# Altium schematic sheet power.SchDoc
size A3
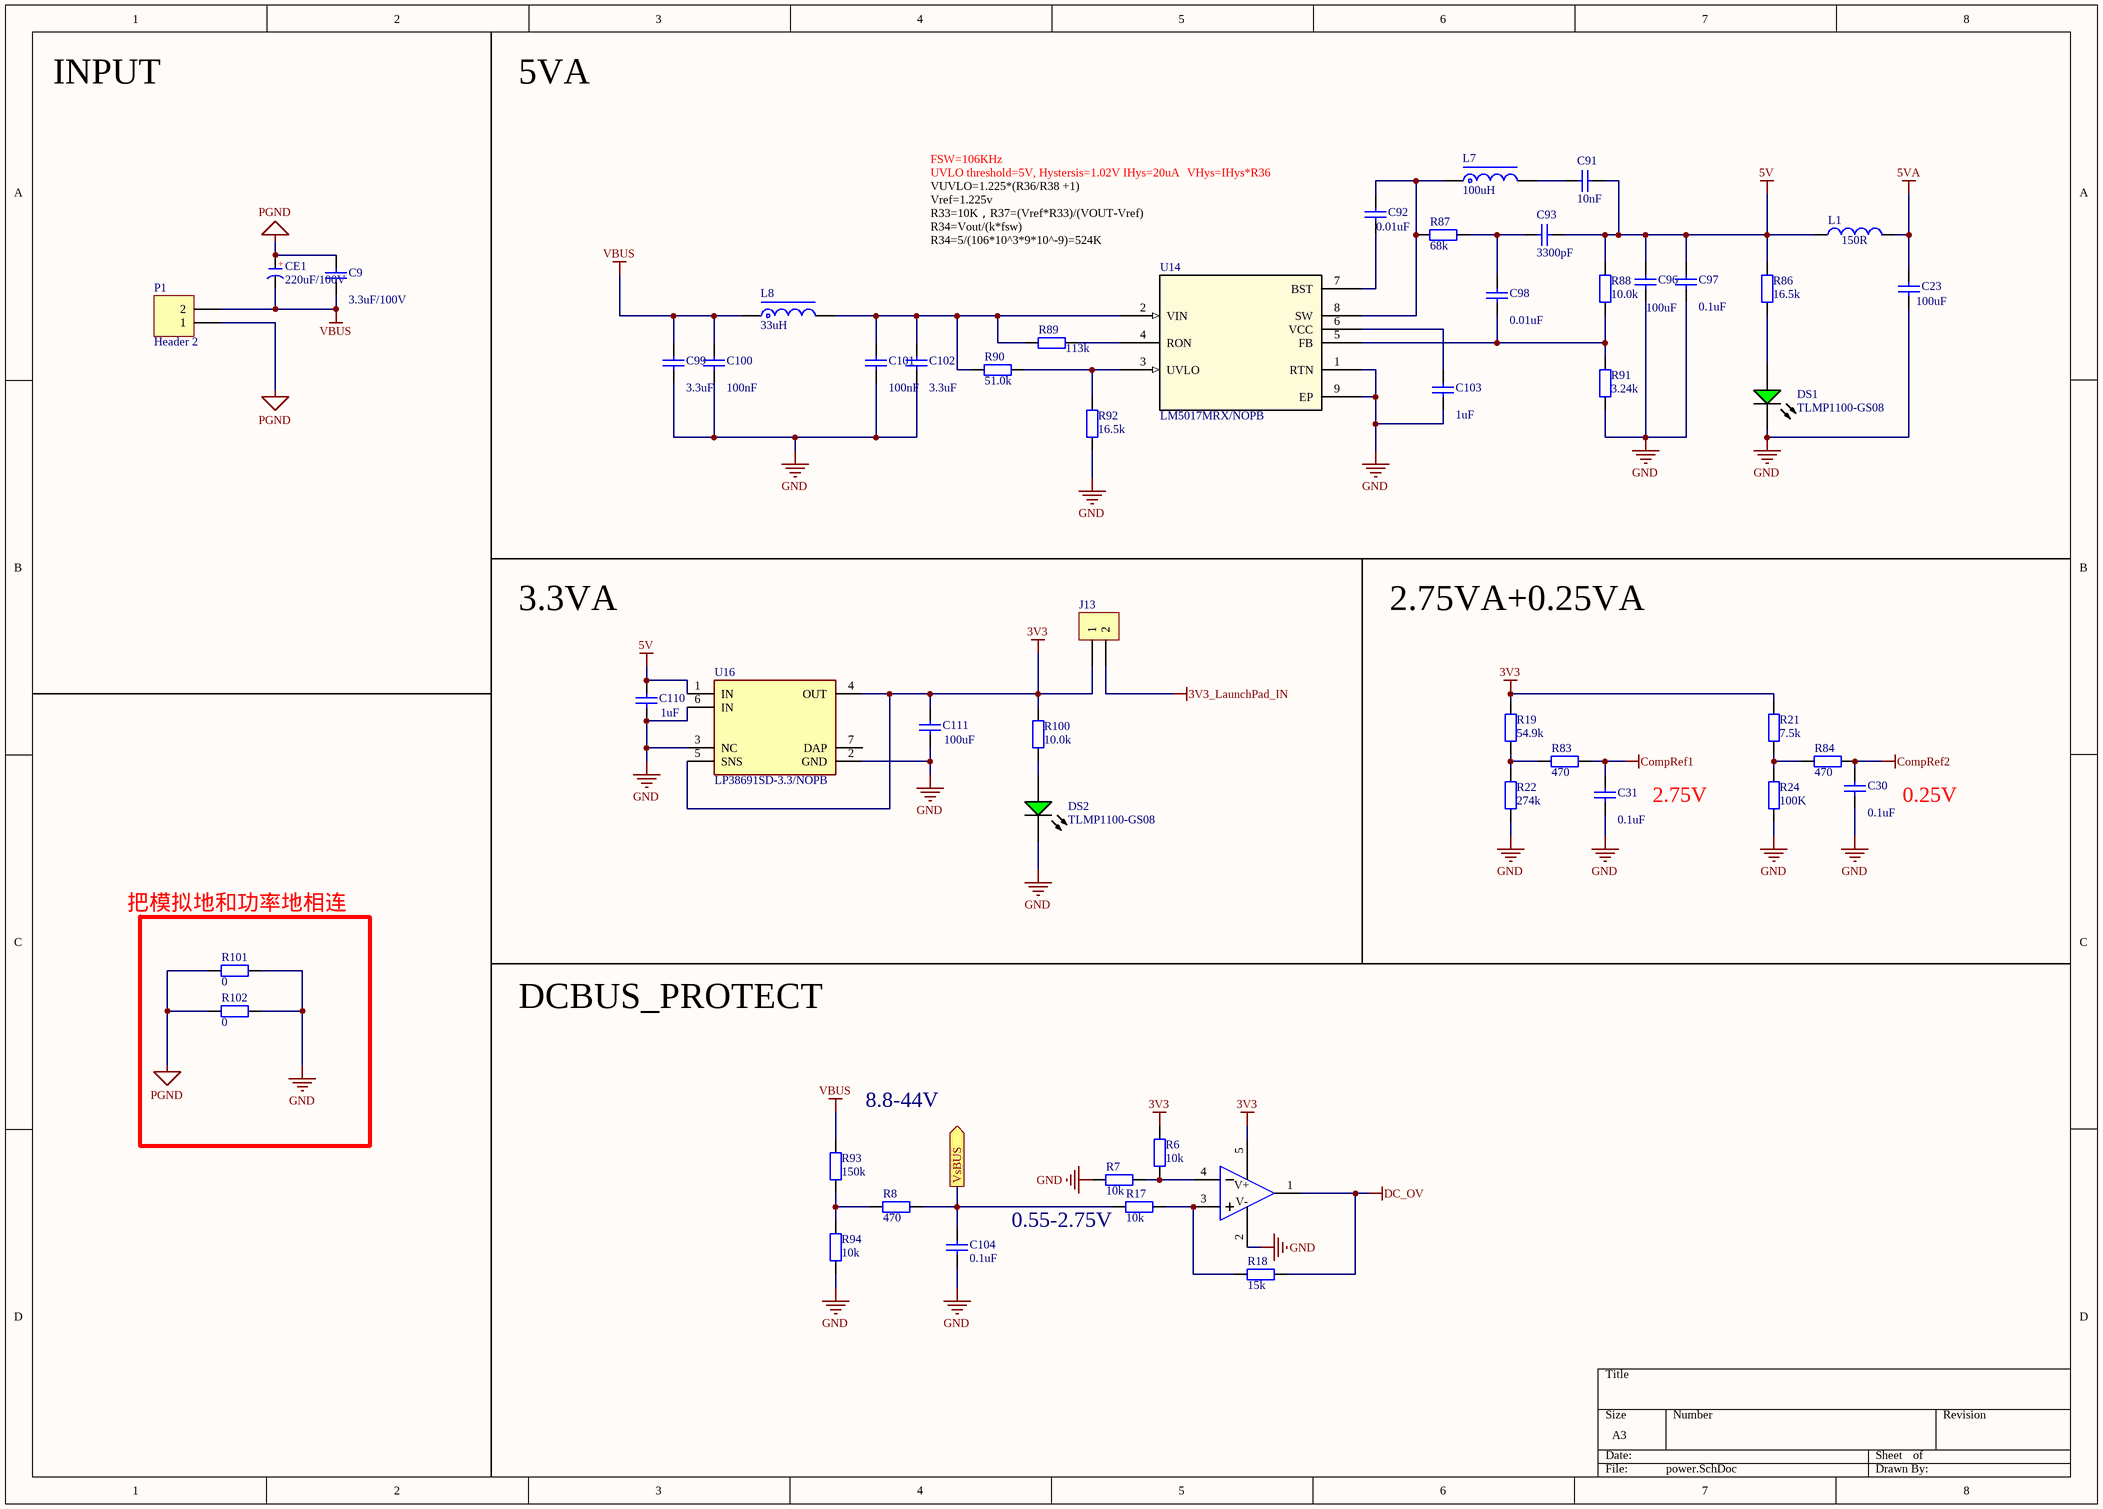
[diagram p0: power.SchDoc]

## Parts
C9  3.3uF/100V  [CAPC1608X06N]
C23  100uF  [CAPC1608X06N]
C30  0.1uF  [CAPC1608X06N]
C31  0.1uF  [CAPC1608X06N]
C91  10nF  [CAPC1608X06N]
C92  0.01uF  [CAPC1608X06N]
C93  3300pF  [CAPC1608X06N]
C96  100uF  [CAPC1608X06N]
C97  0.1uF  [CAPC1608X06N]
C98  0.01uF  [CAPC1608X06N]
C99  3.3uF  [CAPC1608X06N]
C100  100nF  [CAPC1608X06N]
C101  100nF  [CAPC1608X06N]
C102  3.3uF  [CAPC1608X06N]
C103  1uF  [CAPC1608X06N]
C104  0.1uF  [CAPC1608X06N]
C110  1uF  [CAPC1608X06N]
C111  100uF  [CAPC1608X06N]
CE1  220uF/100V  [CAP 5.0*12.5*20]
DS1  TLMP1100-GS08  [VISH-TLMX1100_V]
DS2  TLMP1100-GS08  [VISH-TLMX1100_V]
J13  CON2  [DG1282-5.0]  (value not drawn)
L1  value 150R  [IND-SMD_L5.5-W5.2]  (hidden comment: Inductor)
L7  100uH  [NR4018]
L8  33uH  [NR2520]
P1  Header 2  [HDR1X2]
R6  10k  [RESC1608X05N]
R7  10k  [RESC1608X05N]
R8  470  [RESC1608X05N]
R17  10k  [RESC1608X05N]
R18  15k  [RESC1608X05N]
R19  54.9k  [RESC1608X05N]
R21  7.5k  [RESC1608X05N]
R22  274k  [RESC1608X05N]
R24  100K  [RESC1608X05N]
R83  470  [RESC1608X05N]
R84  470  [RESC1608X05N]
R86  16.5k  [RESC1608X05N]
R87  68k  [RESC1608X05N]
R88  10.0k  [RESC1608X05N]
R89  113k  [RESC1608X05N]
R90  51.0k  [RESC1608X05N]
R91  3.24k  [RESC1608X05N]
R92  16.5k  [RESC1608X05N]
R93  150k  [RESC1608X05N]
R94  10k  [RESC1608X05N]
R100  10.0k  [RESC1608X05N]
R101  0  [RESC1608X05N]
R102  0  [RESC1608X05N]
U6  TLV3201AIDBVR  [SOT-23-5_L3.0-W1.7-P0.95-LS2.8-BR]  (value not drawn)
U14  LM5017MRX/NOPB  [DDA8_3P1X2P41]
U16  LP38691SD-3.3/NOPB  [FP-NGG0006A-MFG]

## Ports
VsBUS (out)

## Nets
3V3: C111.2 J13.1 R6.1 R19.2 R21.2 R100.2 U6.5(VCC) U16.4(OUT) U16.5(SNS)
3V3_LaunchPad_IN: J13.2
5V: C91.2 C93.1 C96.2 C97.2 C110.2 L1.1 R86.2 R88.2 U16.1(IN)
5VA: C23.2 L1.2
CompRef1: C31.2 R83.1
CompRef2: C30.2 R84.1
DC_OV: R18.1 U6.1(OUT)
GND: C23.1 C30.1 C31.1 C96.1 C97.1 C99.2 C100.2 C101.2 C102.1 C103.1 C104.2 C110.1 C111.1 DS1.2(K) DS2.2(K) R7.2 R22.1 R24.1 R91.1 R92.1 R94.1 R101.1 R102.1 U6.2(GND) U14.1(RTN) U14.9(EP) U16.2(GND) U16.3(NC) U16.6(IN)
PGND: C9.2 CE1.1(A) P1.1 R101.2 R102.2
VBUS: C9.1 C99.1 C100.1 CE1.2(K) L8.1 P1.2 R93.2
VsBUS: C104.1 R8.1 R17.2 ; port VsBUS
NetC91_1: C91.1 L7.2
NetC92_1: C92.1 U14.7(BST)
NetC92_2: C92.2 L7.1 R87.2 U14.8(SW)
NetC93_2: C93.2 C98.2 R87.1
NetC98_1: C98.1 R88.1 R91.2 U14.5(FB)
NetC101_1: C101.1 C102.2 L8.2 R89.1 R90.1 U14.2(VIN)
NetC103_2: C103.2 U14.6(VCC)
NetDS1_1: DS1.1(A) R86.1
NetDS2_1: DS2.1(A) R100.1
NetR6_2: R6.2 R7.1 U6.4(IN-)
NetR8_2: R8.2 R93.1 R94.2
NetR17_1: R17.1 R18.2 U6.3(IN+)
NetR19_1: R19.1 R22.2 R83.2
NetR21_1: R21.1 R24.2 R84.2
NetR89_2: R89.2 U14.4(RON)
NetR90_2: R90.2 R92.2 U14.3(UVLO)

Not connected (* = marked no-connect by the designer): U16 7(DAP)

## Notes on the sheet
- INPUT
- 5VA
- FSW=106KHz
- UVLO threshold=5V, Hystersis=1.02V IHys=20uA
- VHys=IHys*R36
- Vref=1.225v
- R33=10K，R37=(Vref*R33)/(VOUT-Vref)
- R34=Vout/(k*fsw)
- R34=5/(106*10^3*9*10^-9)=524K
- VUVLO=1.225*(R36/R38 +1)
- 3.3VA
- 2.75VA+0.25VA
- 2.75V
- 0.25V
- 把模拟地和功率地相连
- DCBUS_PROTECT
- (near R93) 8.8-44V
- (near R17) 0.55-2.75V
- (in symbol CE) +
- (in symbol TLV3201AIDBVR) V+; V-

## Library data of the parts
C9 C23 C30 C31 C91-C93 C96-C104 C110 C111 = Cap: Capacitor; Published: 8-Jun-2000; LatestRevisionDate: 17-Jul-2002; LatestRevisionNote: Re-released for DXP Platform.; PackageReference: RAD-0.3; Publisher: Altium Limited; PackageDescription: Radial Cap, Thru-Hole; 2 Leads; 0.3 in Pin Spacing
  C9: Value: 3.3uF/100V
  C23 C96 C111: Value: 100uF
  C30 C31 C97 C104: Value: 0.1uF
  C91: Value: 10nF
  C92 C98: Value: 0.01uF
  C93: Value: 3300pF
  C99 C102: Value: 3.3uF
  C100 C101: Value: 100nF
  C103 C110: Value: 1uF
CE1 = CE: 直插电解电容; 淘宝ID: 封装库来自淘宝 ID：黄晶宝石; BOM名称: 直插电解电容; 联系售后: https://shop463601444.taobao.com
DS1 DS2 = CMP-1666-00027-1_1: LED, RED, 2.1 V, -40 to 100 degC, 2-Pin SMD (0603), RoHS, Tape and Reel; Type (Capacitors): C0G; Resistance: 100000000000 Ohm; Capacitance: 12 pF; Voltage Rating: 50 V; Tolerance: 5%; Min Operating Temperature: -55degC; REACH SVHC: No SVHC; ComponentLink2Description: Datasheet; ComponentLink1URL: http://www.vishay.com/; Width: 0.8 mm; Package Quantity: 4000; PackageReference: TLMX1100; ComponentLink2URL: http://www.vishay.com/docs/83173/tlmb1100.pdf; Case/Package: 0603; Case Code (Metric): 1608; Packaging: Tape and Reel; Pins: 2; ComponentLink1Description: Manufacturer URL; Max Operating Temperature: 125degC; Height: 0.8 mm; Length: 1.6 mm; Mount: Surface Mount; PackageDescription: 2-Pin Surface Mount Device, Body 1.6 x 0.8 mm; DatasheetVersion: Rev. 2.7, 03/2016; Case Code (Imperial): 0603; Voltage Rating (DC): 50 V; RoHSCompliant: True; Radiation Hardening: No
L1 = Inductor: Code_IEC: 1005; Published: 8-Jun-2000; LatestRevisionDate: 29-May-2009; LatestRevisionNote: IPC-7351 Footprint Added.; PackageReference: 0402-A; Publisher: Altium Limited; Code_JEITA: 0402; PackageDescription: Chip Inductor
L7 L8 = L-NR: NR磁胶电感; 版权归属: 来自淘宝 ID：黄晶宝石; BOM名称: NR磁胶电感; 联系售后: https://shop463601444.taobao.com
P1 = Header 2: Header, 2-Pin; LatestRevisionDate: 17-Jul-2002; LatestRevisionNote: Re-released for DXP Platform.; Publisher: Altium Limited
R6-R8 R17-R19 R21 R22 R24 R83 R84 R86-R94 R100-R102 = 0603 100KΩ (1003) 1%_4: 贴片电阻; Value: 1MΩ(1%); ComponentLink1Description: 供应商链接; ComponentLink1URL: http://www.szlcsc.com/product/details_26546.html; Package: 0603; Supplier: LC; SuppliersPartNumber: C25803
U6 = TLV3201AIDBVR: Manufacturer: TI(德州仪器); Add into BOM: yes; Input Offset Voltage (Vos): 1mV; Input Bias Current (Ib): 5nA; Propagation Delay Time: 40ns; Input Hysteresis Voltage (Vhys): 1.2mV; Common Mode Rejection Ratio (CMRR): 70dB; Supply Voltage: 2.7V~5.5V; Output Type: 推挽; Supply Current: 40uA; Symbol: TLV3201AIDBVR; Device: TLV3201AIDBVR; LCSC Part Name: TLV3201AIDBVR; Supplier Part: C105188; Manufacturer Part: TLV3201AIDBVR; Supplier Footprint: SOT-23-5; JLCPCB Part Class: Extended Part; Datasheet: https://www.ti.com/cn/lit/gpn/tlv3201; Supplier: LCSC; Convert to PCB: yes; Output Mode: -; Rail-to-Rail: -; Operating Temperature: -40℃~+125℃
U14 = LM5017MRXNOPB: No Description Available; Mfr_Name: Texas Instruments; Copyright: Copyright (C) 2024 Ultra Librarian. All rights reserved.; Manufacturer_Part_Number: LM5017MRX/NOPB; RefDes: RefDes; Type: DEV
U16 = CMP-0062-01590-5: IC REG LINEAR 3.3V 500MA 6WSON; Min Input Voltage: 2.7V; Number of Regulators: 1; Polarity: Positive; Dropout Voltage: 330mV; Output Type: Fixed; Output Voltage Accuracy: 2%; Max Input Voltage: 10V; Quiescent Current: 100uA; Max Output Current: 500mA; Output Current: 500mA; Package Quantity: 1000; Nominal Output Voltage: 3.3V; Number of Pins: 6; Number of Outputs: 1; Length: 3mm; Output Voltage: 3.3V; Height: 0.86mm; REACH SVHC: No SVHC; Accuracy: 2%; Lead Free: Lead Free; Mount: Surface Mount; Packaging: Tape and Reel; Contact Plating: Tin; Max Operating Temperature: 125°C; Min Operating Temperature: -40°C; Radiation Hardening: No; Width: 3mm